# Altium project Flatcaster.PrjPcb
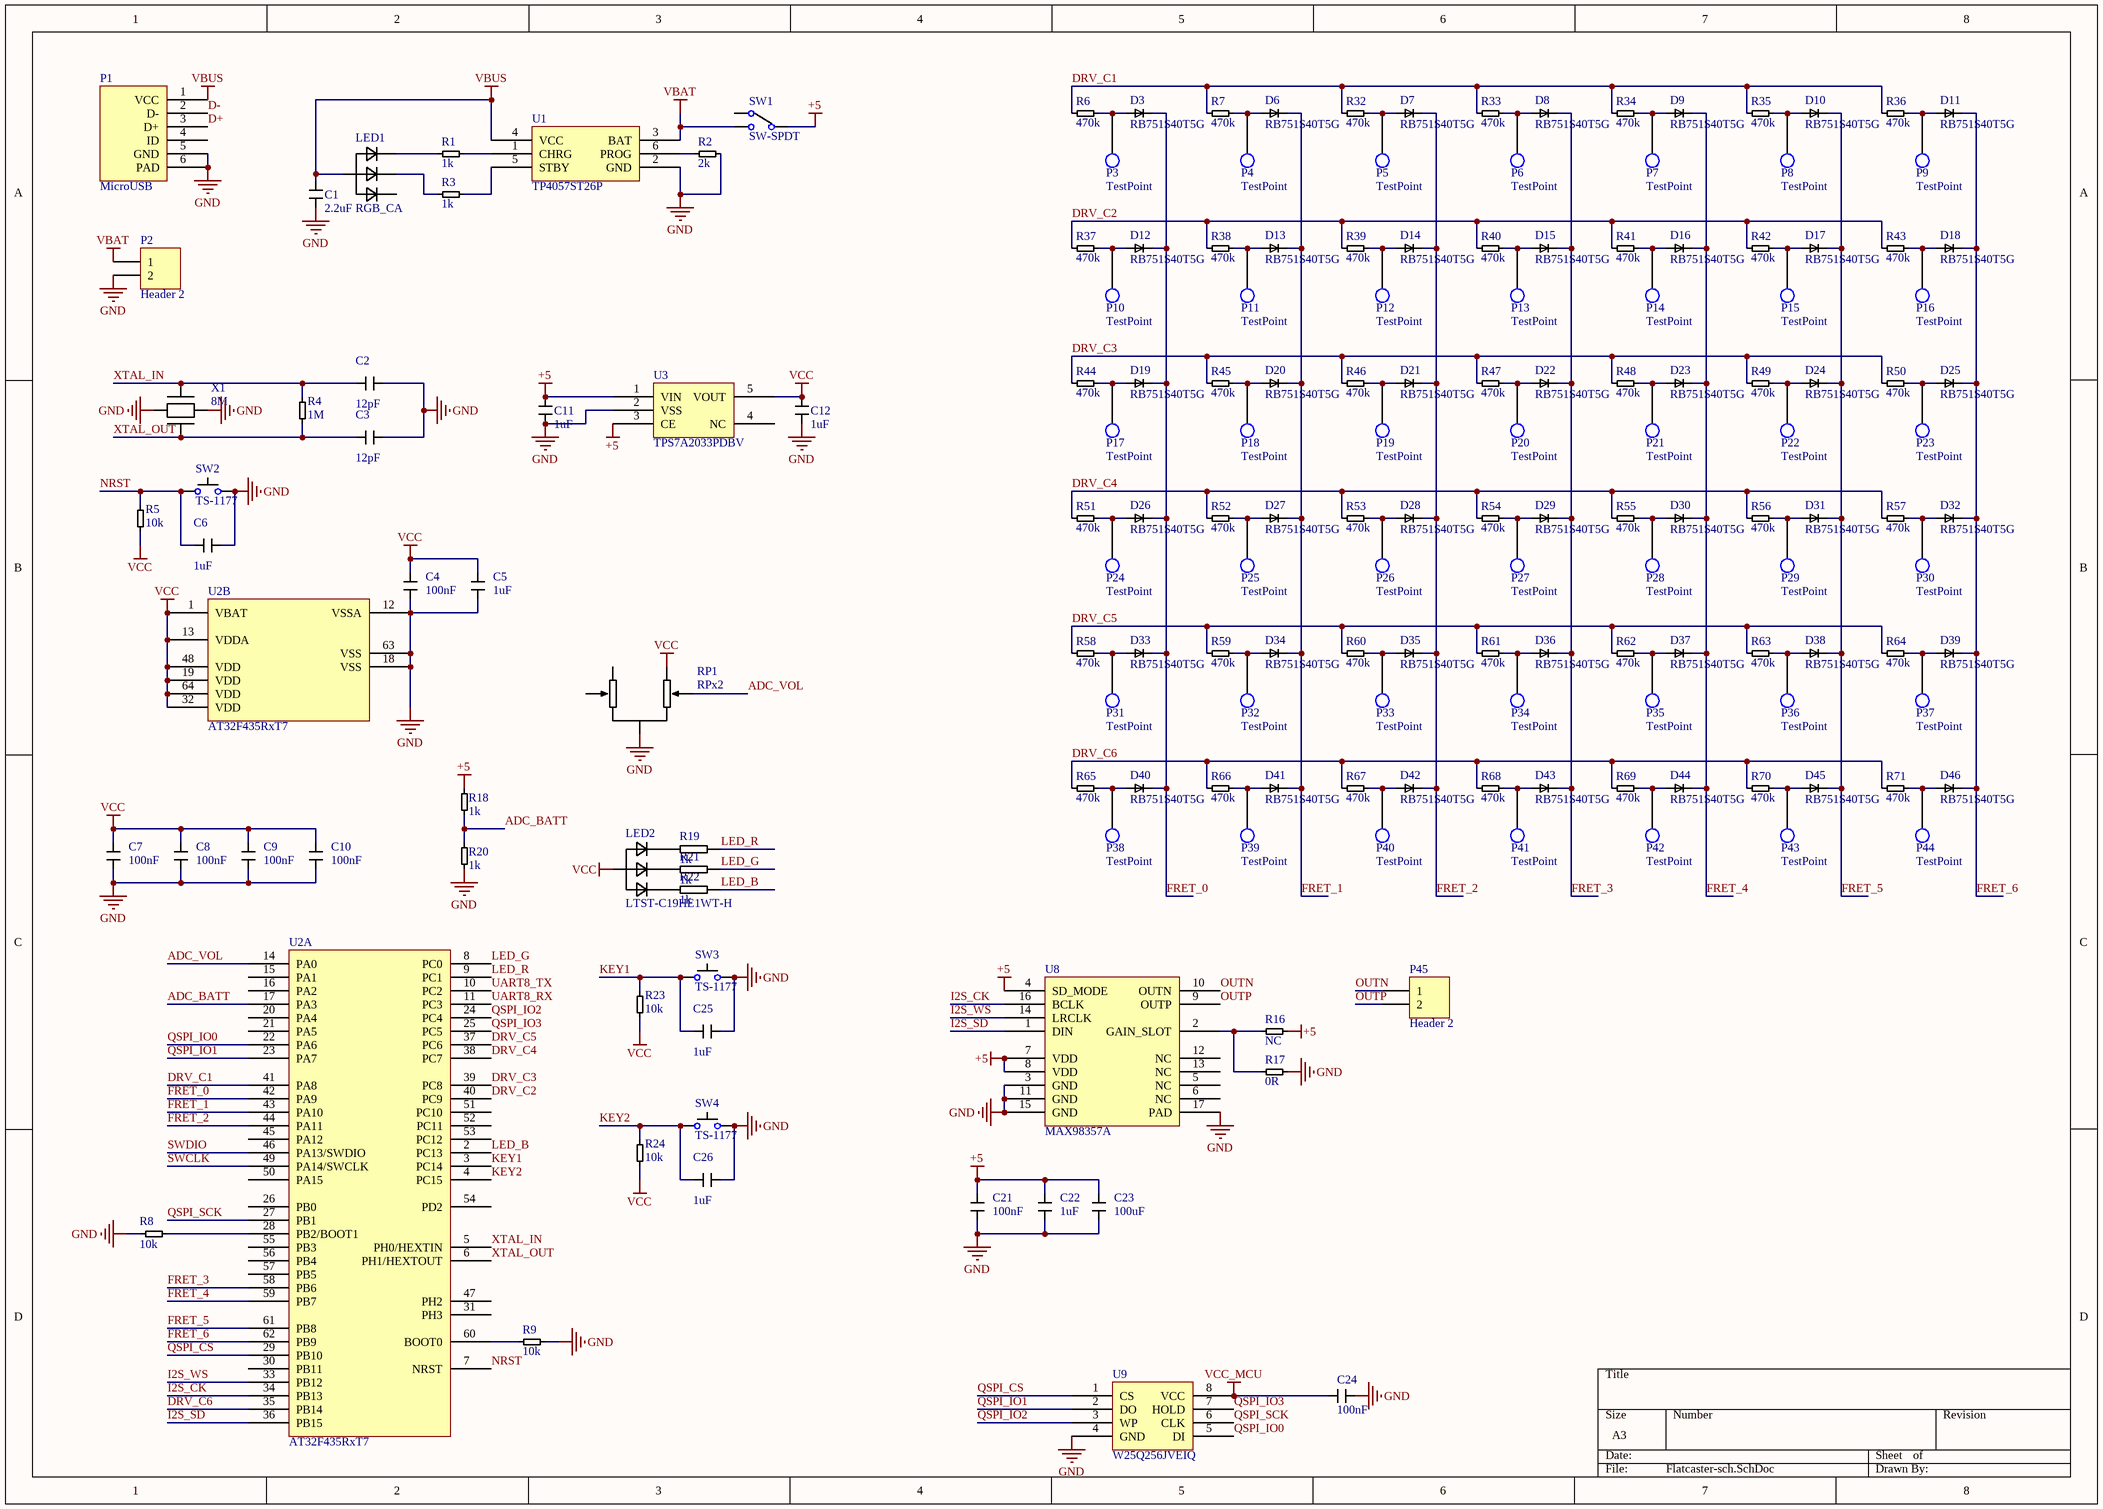
[diagram p0: Flatcaster-sch.SchDoc]
2 sheets, 203 parts. Net scope: global (net labels, ports and power ports of the same name join across sheets).
Board file: Flatcaster-pcb.PcbDoc
Sheets:
  Flatcaster-sch.SchDoc
  Flatcaster-Link-sch.SchDoc

## Sheet Flatcaster-sch.SchDoc
size A3; SheetNumber: 1; SheetTotal: 2

### Parts
C1  2.2uF  [0603-Cap]
C2  12pF  [0603-Cap]
C3  12pF  [0603-Cap]
C4  100nF  [0603-Cap]
C5  1uF  [0603-Cap]
C6  1uF  [0603-Cap]
C7  100nF  [0603-Cap]
C8  100nF  [0603-Cap]
C9  100nF  [0603-Cap]
C10  100nF  [0603-Cap]
C11  1uF  [0603-Cap]
C12  1uF  [0603-Cap]
C21  100nF  [0603-Cap]
C22  1uF  [0603-Cap]
C23  100uF  [1206-C]
C24  100nF  [0603-Cap]
C25  1uF  [0603-Cap]
C26  1uF  [0603-Cap]
D3  RB751S40T5G  [SOD-523]
D6  RB751S40T5G  [SOD-523]
D7  RB751S40T5G  [SOD-523]
D8  RB751S40T5G  [SOD-523]
D9  RB751S40T5G  [SOD-523]
D10  RB751S40T5G  [SOD-523]
D11  RB751S40T5G  [SOD-523]
D12  RB751S40T5G  [SOD-523]
D13  RB751S40T5G  [SOD-523]
D14  RB751S40T5G  [SOD-523]
D15  RB751S40T5G  [SOD-523]
D16  RB751S40T5G  [SOD-523]
D17  RB751S40T5G  [SOD-523]
D18  RB751S40T5G  [SOD-523]
D19  RB751S40T5G  [SOD-523]
D20  RB751S40T5G  [SOD-523]
D21  RB751S40T5G  [SOD-523]
D22  RB751S40T5G  [SOD-523]
D23  RB751S40T5G  [SOD-523]
D24  RB751S40T5G  [SOD-523]
D25  RB751S40T5G  [SOD-523]
D26  RB751S40T5G  [SOD-523]
D27  RB751S40T5G  [SOD-523]
D28  RB751S40T5G  [SOD-523]
D29  RB751S40T5G  [SOD-523]
D30  RB751S40T5G  [SOD-523]
D31  RB751S40T5G  [SOD-523]
D32  RB751S40T5G  [SOD-523]
D33  RB751S40T5G  [SOD-523]
D34  RB751S40T5G  [SOD-523]
D35  RB751S40T5G  [SOD-523]
D36  RB751S40T5G  [SOD-523]
D37  RB751S40T5G  [SOD-523]
D38  RB751S40T5G  [SOD-523]
D39  RB751S40T5G  [SOD-523]
D40  RB751S40T5G  [SOD-523]
D41  RB751S40T5G  [SOD-523]
D42  RB751S40T5G  [SOD-523]
D43  RB751S40T5G  [SOD-523]
D44  RB751S40T5G  [SOD-523]
D45  RB751S40T5G  [SOD-523]
D46  RB751S40T5G  [SOD-523]
LED1  RGB_CA  [RGB1.6*1.6]
LED2  LTST-C19HE1WT-H  [RGB1.6*1.6]
P1  MicroUSB  [MicroUSB]
P2  Header 2  [SH2.0 2P]
P3  TestPoint  [TestPoint]
P4  TestPoint  [TestPoint]
P5  TestPoint  [TestPoint]
P6  TestPoint  [TestPoint]
P7  TestPoint  [TestPoint]
P8  TestPoint  [TestPoint]
P9  TestPoint  [TestPoint]
P10  TestPoint  [TestPoint]
P11  TestPoint  [TestPoint]
P12  TestPoint  [TestPoint]
P13  TestPoint  [TestPoint]
P14  TestPoint  [TestPoint]
P15  TestPoint  [TestPoint]
P16  TestPoint  [TestPoint]
P17  TestPoint  [TestPoint]
P18  TestPoint  [TestPoint]
P19  TestPoint  [TestPoint]
P20  TestPoint  [TestPoint]
P21  TestPoint  [TestPoint]
P22  TestPoint  [TestPoint]
P23  TestPoint  [TestPoint]
P24  TestPoint  [TestPoint]
P25  TestPoint  [TestPoint]
P26  TestPoint  [TestPoint]
P27  TestPoint  [TestPoint]
P28  TestPoint  [TestPoint]
P29  TestPoint  [TestPoint]
P30  TestPoint  [TestPoint]
P31  TestPoint  [TestPoint]
P32  TestPoint  [TestPoint]
P33  TestPoint  [TestPoint]
P34  TestPoint  [TestPoint]
P35  TestPoint  [TestPoint]
P36  TestPoint  [TestPoint]
P37  TestPoint  [TestPoint]
P38  TestPoint  [TestPoint]
P39  TestPoint  [TestPoint]
P40  TestPoint  [TestPoint]
P41  TestPoint  [TestPoint]
P42  TestPoint  [TestPoint]
P43  TestPoint  [TestPoint]
P44  TestPoint  [TestPoint]
P45  Header 2  [HDR1X2]
R1  1k  [0603]
R2  2k  [0603]
R3  1k  [0603]
R4  1M  [0603]
R5  10k  [0603]
R6  470k  [0603]
R7  470k  [0603]
R8  10k  [0603]
R9  10k  [0603]
R16  NC  [0603]
R17  0R  [0603]
R18  1k  [0603]
R19  1k  [0603]
R20  1k  [0603]
R21  1k  [0603]
R22  1k  [0603]
R23  10k  [0603]
R24  10k  [0603]
R32  470k  [0603]
R33  470k  [0603]
R34  470k  [0603]
R35  470k  [0603]
R36  470k  [0603]
R37  470k  [0603]
R38  470k  [0603]
R39  470k  [0603]
R40  470k  [0603]
R41  470k  [0603]
R42  470k  [0603]
R43  470k  [0603]
R44  470k  [0603]
R45  470k  [0603]
R46  470k  [0603]
R47  470k  [0603]
R48  470k  [0603]
R49  470k  [0603]
R50  470k  [0603]
R51  470k  [0603]
R52  470k  [0603]
R53  470k  [0603]
R54  470k  [0603]
R55  470k  [0603]
R56  470k  [0603]
R57  470k  [0603]
R58  470k  [0603]
R59  470k  [0603]
R60  470k  [0603]
R61  470k  [0603]
R62  470k  [0603]
R63  470k  [0603]
R64  470k  [0603]
R65  470k  [0603]
R66  470k  [0603]
R67  470k  [0603]
R68  470k  [0603]
R69  470k  [0603]
R70  470k  [0603]
R71  470k  [0603]
RP1  RPx2  [RK10J]
SW1  SW-SPDT  [TA-3524A-A1]
SW2  TS-1177  [BTN3*3]
SW3  TS-1177  [BTN3*3]
SW4  TS-1177  [BTN3*3]
U1  TP4057ST26P  [SOT236]
U2  AT32F435RxT7  [LQFP-64]  (parts A,B of 2)
U3  TPS7A2033PDBV  [SOT23-5]
U8  MAX98357A  [QFN16-0.5-1.1PAD]
U9  W25Q256JVEIQ  [WPDFN-8-6x5]
X1  8M  [XTAL-3225-4P]

### Nets
+5: C11.2 C21.2 C22.2 C23.2 R16.1 R18.2 SW1.1 U3.1(VIN) U3.3(CE) U8.4(SD_MODE) U8.7(VDD) U8.8(VDD)
GND: C1.1 C2.1 C3.1 C4.1 C5.1 C6.1 C7.1 C8.1 C9.1 C10.1 C11.1 C12.1 C21.1 C22.1 C23.1 C24.1 C25.1 C26.1 P1.5(GND) P1.6(PAD) P2.2 R2.2 R8.1 R9.1 R17.1 R20.1 RP1.1 SW2.2 SW3.2 SW4.2 U1.2(GND) U2.12(VSSA) U2.18(VSS) U2.63(VSS) U3.2(VSS) U8.3(GND) U8.11(GND) U8.15(GND) U8.17(PAD) U9.4(GND) X1.2 X1.4
VBAT: P2.1 SW1.2 U1.3(BAT)
VBUS: C1.2 LED1.4 P1.1(VCC) U1.4(VCC)
VCC: C4.2 C5.2 C7.2 C8.2 C9.2 C10.2 C12.2 LED2.4 R5.1 R23.1 R24.1 RP1.4 U2.1(VBAT) U2.13(VDDA) U2.19(VDD) U2.32(VDD) U2.48(VDD) U2.64(VDD) U3.5(VOUT)
VCC_MCU: C24.2 U9.8(VCC)
ADC_BATT: R18.1 R20.2 U2.17(PA3)
ADC_VOL: RP1.3 U2.14(PA0)
D+: P1.3(D+)
D-: P1.2(D-)
DRV_C1: R6.1 R7.1 R32.1 R33.1 R34.1 R35.1 R36.1 U2.41(PA8)
DRV_C2: R37.1 R38.1 R39.1 R40.1 R41.1 R42.1 R43.1 U2.40(PC9)
DRV_C3: R44.1 R45.1 R46.1 R47.1 R48.1 R49.1 R50.1 U2.39(PC8)
DRV_C4: R51.1 R52.1 R53.1 R54.1 R55.1 R56.1 R57.1 U2.38(PC7)
DRV_C5: R58.1 R59.1 R60.1 R61.1 R62.1 R63.1 R64.1 U2.37(PC6)
DRV_C6: R65.1 R66.1 R67.1 R68.1 R69.1 R70.1 R71.1 U2.35(PB14)
FRET_0: D3.2 D12.2 D19.2 D26.2 D33.2 D40.2 U2.42(PA9)
FRET_1: D6.2 D13.2 D20.2 D27.2 D34.2 D41.2 U2.43(PA10)
FRET_2: D7.2 D14.2 D21.2 D28.2 D35.2 D42.2 U2.44(PA11)
FRET_3: D8.2 D15.2 D22.2 D29.2 D36.2 D43.2 U2.58(PB6)
FRET_4: D9.2 D16.2 D23.2 D30.2 D37.2 D44.2 U2.59(PB7)
FRET_5: D10.2 D17.2 D24.2 D31.2 D38.2 D45.2 U2.61(PB8)
FRET_6: D11.2 D18.2 D25.2 D32.2 D39.2 D46.2 U2.62(PB9)
I2S_CK: U2.34(PB13) U8.16(BCLK)
I2S_SD: U2.36(PB15) U8.1(DIN)
I2S_WS: U2.33(PB12) U8.14(LRCLK)
KEY1: C25.2 R23.2 SW3.1 U2.3(PC14)
KEY2: C26.2 R24.2 SW4.1 U2.4(PC15)
LED_B: R22.2 U2.2(PC13)
LED_G: R21.2 U2.8(PC0)
LED_R: R19.2 U2.9(PC1)
NRST: C6.2 R5.2 SW2.1 U2.7(NRST)
OUTN: P45.1 U8.10(OUTN)
OUTP: P45.2 U8.9(OUTP)
QSPI_CS: U2.29(PB10) U9.1(CS)
QSPI_IO0: U2.22(PA6) U9.5(DI)
QSPI_IO1: U2.23(PA7) U9.2(DO)
QSPI_IO2: U2.24(PC4) U9.3(WP)
QSPI_IO3: U2.25(PC5) U9.7(HOLD)
QSPI_SCK: U2.27(PB1) U9.6(CLK)
SWCLK: U2.49(PA14/SWCLK)
SWDIO: U2.46(PA13/SWDIO)
UART8_RX: U2.11(PC3)
UART8_TX: U2.10(PC2)
XTAL_IN: C2.2 R4.2 U2.5(PH0/HEXTIN) X1.3
XTAL_OUT: C3.2 R4.1 U2.6(PH1/HEXTOUT) X1.1
NetD3_1: D3.1 P3.1 R6.2
NetD6_1: D6.1 P4.1 R7.2
NetD7_1: D7.1 P5.1 R32.2
NetD8_1: D8.1 P6.1 R33.2
NetD9_1: D9.1 P7.1 R34.2
NetD10_1: D10.1 P8.1 R35.2
NetD11_1: D11.1 P9.1 R36.2
NetD12_1: D12.1 P10.1 R37.2
NetD13_1: D13.1 P11.1 R38.2
NetD14_1: D14.1 P12.1 R39.2
NetD15_1: D15.1 P13.1 R40.2
NetD16_1: D16.1 P14.1 R41.2
NetD17_1: D17.1 P15.1 R42.2
NetD18_1: D18.1 P16.1 R43.2
NetD19_1: D19.1 P17.1 R44.2
NetD20_1: D20.1 P18.1 R45.2
NetD21_1: D21.1 P19.1 R46.2
NetD22_1: D22.1 P20.1 R47.2
NetD23_1: D23.1 P21.1 R48.2
NetD24_1: D24.1 P22.1 R49.2
NetD25_1: D25.1 P23.1 R50.2
NetD26_1: D26.1 P24.1 R51.2
NetD27_1: D27.1 P25.1 R52.2
NetD28_1: D28.1 P26.1 R53.2
NetD29_1: D29.1 P27.1 R54.2
NetD30_1: D30.1 P28.1 R55.2
NetD31_1: D31.1 P29.1 R56.2
NetD32_1: D32.1 P30.1 R57.2
NetD33_1: D33.1 P31.1 R58.2
NetD34_1: D34.1 P32.1 R59.2
NetD35_1: D35.1 P33.1 R60.2
NetD36_1: D36.1 P34.1 R61.2
NetD37_1: D37.1 P35.1 R62.2
NetD38_1: D38.1 P36.1 R63.2
NetD39_1: D39.1 P37.1 R64.2
NetD40_1: D40.1 P38.1 R65.2
NetD41_1: D41.1 P39.1 R66.2
NetD42_1: D42.1 P40.1 R67.2
NetD43_1: D43.1 P41.1 R68.2
NetD44_1: D44.1 P42.1 R69.2
NetD45_1: D45.1 P43.1 R70.2
NetD46_1: D46.1 P44.1 R71.2
NetLED1_1: LED1.1 R1.1
NetLED1_2: LED1.2 R3.1
NetLED2_1: LED2.1 R19.1
NetLED2_2: LED2.2 R21.1
NetLED2_3: LED2.3 R22.1
NetR1_2: R1.2 U1.1(CHRG)
NetR2_1: R2.1 U1.6(PROG)
NetR3_2: R3.2 U1.5(STBY)
NetR8_2: R8.2 U2.28(PB2/BOOT1)
NetR9_2: R9.2 U2.60(BOOT0)
NetR16_2: R16.2 R17.2 U8.2(GAIN_SLOT)

Not connected (* = marked no-connect by the designer): LED1 3; P1 4(ID); RP1 2 5; SW1 3(___); U2 15(PA1) 16(PA2) 20(PA4) 21(PA5) 26(PB0) 30(PB11) 31(PH3) 45(PA12) 47(PH2) 50(PA15) 51(PC10) 52(PC11) 53(PC12) 54(PD2) 55(PB3) 56(PB4) 57(PB5); U3 4(NC); U8 5(NC) 6(NC) 12(NC) 13(NC)

### Library data of the parts
C1-C12 C21-C26 = Cap
D3 D6-D46 = Diode
LED2 = RGB_CA: C427425
P2 P45 = Header 2: Header, 2-Pin; LatestRevisionDate: 17-Jul-2002; LatestRevisionNote: Re-released for DXP Platform.; Publisher: Altium Limited
R1-R9 R16-R24 R32-R71 = Res
SW1 = SW-SPDT: C514014
SW2-SW4 = Btn: C561512
U3 = ME6211
U9 = W25QxxxVE/A
X1 = XTAL-4LEAD: C2682774

## Sheet Flatcaster-Link-sch.SchDoc
size A4; SheetNumber: 2; SheetTotal: 2
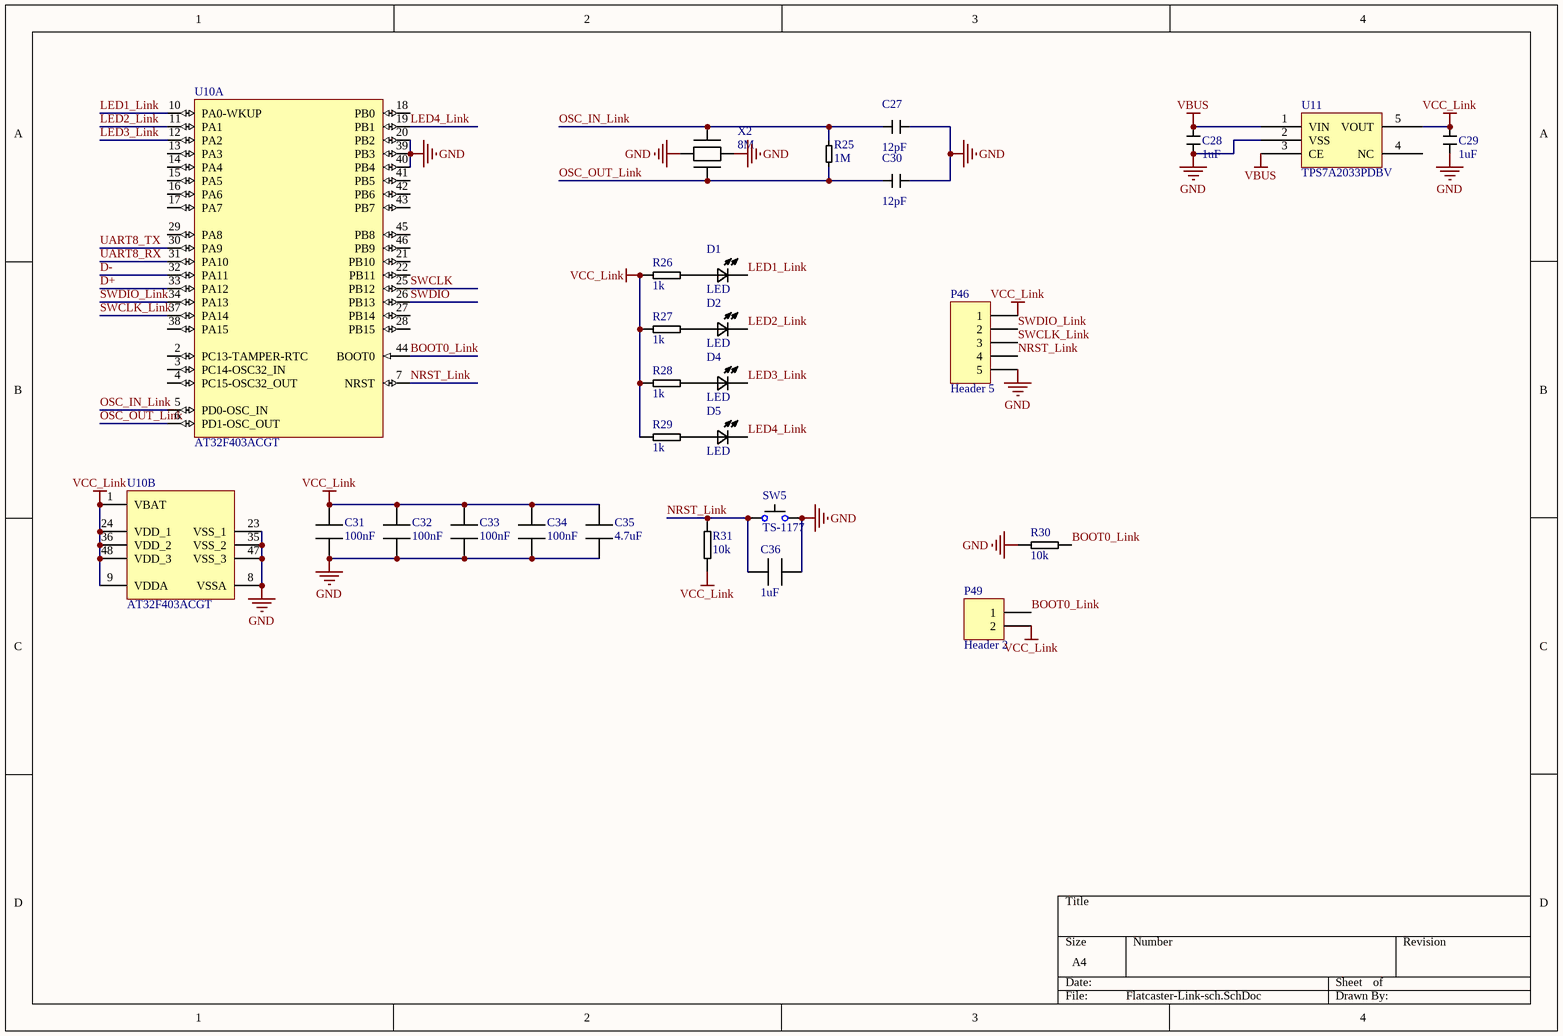
[diagram p1: Flatcaster-Link-sch.SchDoc]

### Parts
C27  12pF  [0603-Cap]
C28  1uF  [0603-Cap]
C29  1uF  [0603-Cap]
C30  12pF  [0603-Cap]
C31  100nF  [0603-Cap]
C32  100nF  [0603-Cap]
C33  100nF  [0603-Cap]
C34  100nF  [0603-Cap]
C35  4.7uF  [0603-Cap]
C36  1uF  [0603-Cap]
D1  LED  [0603-1]
D2  LED  [0603-1]
D4  LED  [0603-1]
D5  LED  [0603-1]
P46  Header 5  [HDR1X5]
P49  Header 2  [HDR1X2]
R25  1M  [0603]
R26  1k  [0603]
R27  1k  [0603]
R28  1k  [0603]
R29  1k  [0603]
R30  10k  [0603]
R31  10k  [0603]
SW5  TS-1177  [BTN3*3]
U10  AT32F403ACGT  [STM-LQFP48_N]  (parts A,B of 2)
U11  TPS7A2033PDBV  [SOT23-5]
X2  8M  [XTAL-3225-4P]

### Nets
GND: C27.1 C28.1 C29.1 C30.1 C31.2 C32.2 C33.2 C34.2 C35.2 C36.1 P46.5 R30.2 SW5.2 U10.8(VSSA) U10.20(PB2) U10.23(VSS_1) U10.35(VSS_2) U10.39(PB3) U10.40(PB4) U10.47(VSS_3) U11.2(VSS) X2.2 X2.4
VBUS: C28.2 U11.1(VIN) U11.3(CE)
VCC_Link: C29.2 C31.1 C32.1 C33.1 C34.1 C35.1 P46.1 P49.2 R26.2 R27.2 R28.2 R29.2 R31.1 U10.1(VBAT) U10.9(VDDA) U10.24(VDD_1) U10.36(VDD_2) U10.48(VDD_3) U11.5(VOUT)
BOOT0_Link: P49.1 R30.1 U10.44(BOOT0)
D+: U10.33(PA12)
D-: U10.32(PA11)
LED1_Link: D1.2 U10.10(PA0-WKUP)
LED2_Link: D2.2 U10.11(PA1)
LED3_Link: D4.2 U10.12(PA2)
LED4_Link: D5.2 U10.19(PB1)
NRST_Link: C36.2 P46.4 R31.2 SW5.1 U10.7(NRST)
OSC_IN_Link: C27.2 R25.2 U10.5(PD0-OSC_IN) X2.3
OSC_OUT_Link: C30.2 R25.1 U10.6(PD1-OSC_OUT) X2.1
SWCLK: U10.25(PB12)
SWCLK_Link: P46.3 U10.37(PA14)
SWDIO: U10.26(PB13)
SWDIO_Link: P46.2 U10.34(PA13)
UART8_RX: U10.31(PA10)
UART8_TX: U10.30(PA9)
NetD1_1: D1.1 R26.1
NetD2_1: D2.1 R27.1
NetD4_1: D4.1 R28.1
NetD5_1: D5.1 R29.1

Not connected (* = marked no-connect by the designer): U10 2(PC13-TAMPER-RTC) 3(PC14-OSC32_IN) 4(PC15-OSC32_OUT) 13(PA3) 14(PA4) 15(PA5) 16(PA6) 17(PA7) 18(PB0) 21(PB10) 22(PB11) 27(PB14) 28(PB15) 29(PA8) 38(PA15) 41(PB5) 42(PB6) 43(PB7) 45(PB8) 46(PB9); U11 4(NC)

### Library data of the parts
C27-C36 = Cap
P46 = Header 5: Header, 5-Pin; LatestRevisionDate: 17-Jul-2002; LatestRevisionNote: Re-released for DXP Platform.; Publisher: Altium Limited
P49 = Header 2: Header, 2-Pin; LatestRevisionDate: 17-Jul-2002; LatestRevisionNote: Re-released for DXP Platform.; Publisher: Altium Limited
R25-R31 = Res
SW5 = Btn: C561512
U10 = STM32F103CBT6: A/D Converter: 2x12-bit (10 Channel); Core: ARM Cortex-M3; FLASH Size (Prog) (kB): 128; I/Os (High Current): 37; Internal RAM Size (kB): 20; Operating Frequency(F) (Processor speed) (MHz): 72; Packing: Tray; Supply Voltage(Vcc) min (V): 2; DatasheetVersion: Rev. 16; PackageVersion: Rev. 6, 06/2013; PackageReference: LQFP48; PackageDescription: 48-Pin Low Profile Quad Flat Package, 7 x 7 mm Body, 0.5 mm Pitch; Supplier 1: Digi-Key; Supplier Part Number 1: 497-6288-ND; Supplier 2: Farnell; Supplier Part Number 2: 1606327; Supplier 3: Newark; Supplier Part Number 3: 11N8296; Supplier 4: Newark; Supplier Part Number 4: 57P1214; Supplier 5: Mouser; Supplier Part Number 5: 511-STM32F103CBT6; Mounting Technology: Surface Mount; PartNumber: STM32F103CBT6; ComponentLink1Description: Manufacturer URL; ComponentLink1URL: http://www.st.com/web/en/home.html; ComponentLink2Description: Datasheet; ComponentLink2URL: http://www.st.com/st-web-ui/static/active/en/resource/technical/document/datasheet/CD00161566.pdf; ComponentLink3Description: Package Specification; ComponentLink3URL: http://www.st.com/st-web-ui/static/active/en/resource/technical/document/datasheet/DM00058181.pdf
U11 = ME6211
X2 = XTAL-4LEAD: C2682774

## Nets that join several sheets
GND: Flatcaster-sch (42 pins), Flatcaster-Link-sch (23 pins)
VBUS: Flatcaster-sch (C1.2 LED1.4 P1.1 U1.4), Flatcaster-Link-sch (C28.2 U11.1 U11.3)
D+: Flatcaster-sch (P1.3), Flatcaster-Link-sch (U10.33)
D-: Flatcaster-sch (P1.2), Flatcaster-Link-sch (U10.32)
SWCLK: Flatcaster-sch (U2.49), Flatcaster-Link-sch (U10.25)
SWDIO: Flatcaster-sch (U2.46), Flatcaster-Link-sch (U10.26)
UART8_RX: Flatcaster-sch (U2.11), Flatcaster-Link-sch (U10.31)
UART8_TX: Flatcaster-sch (U2.10), Flatcaster-Link-sch (U10.30)